# Altium project Pong_PCB.PrjPcb
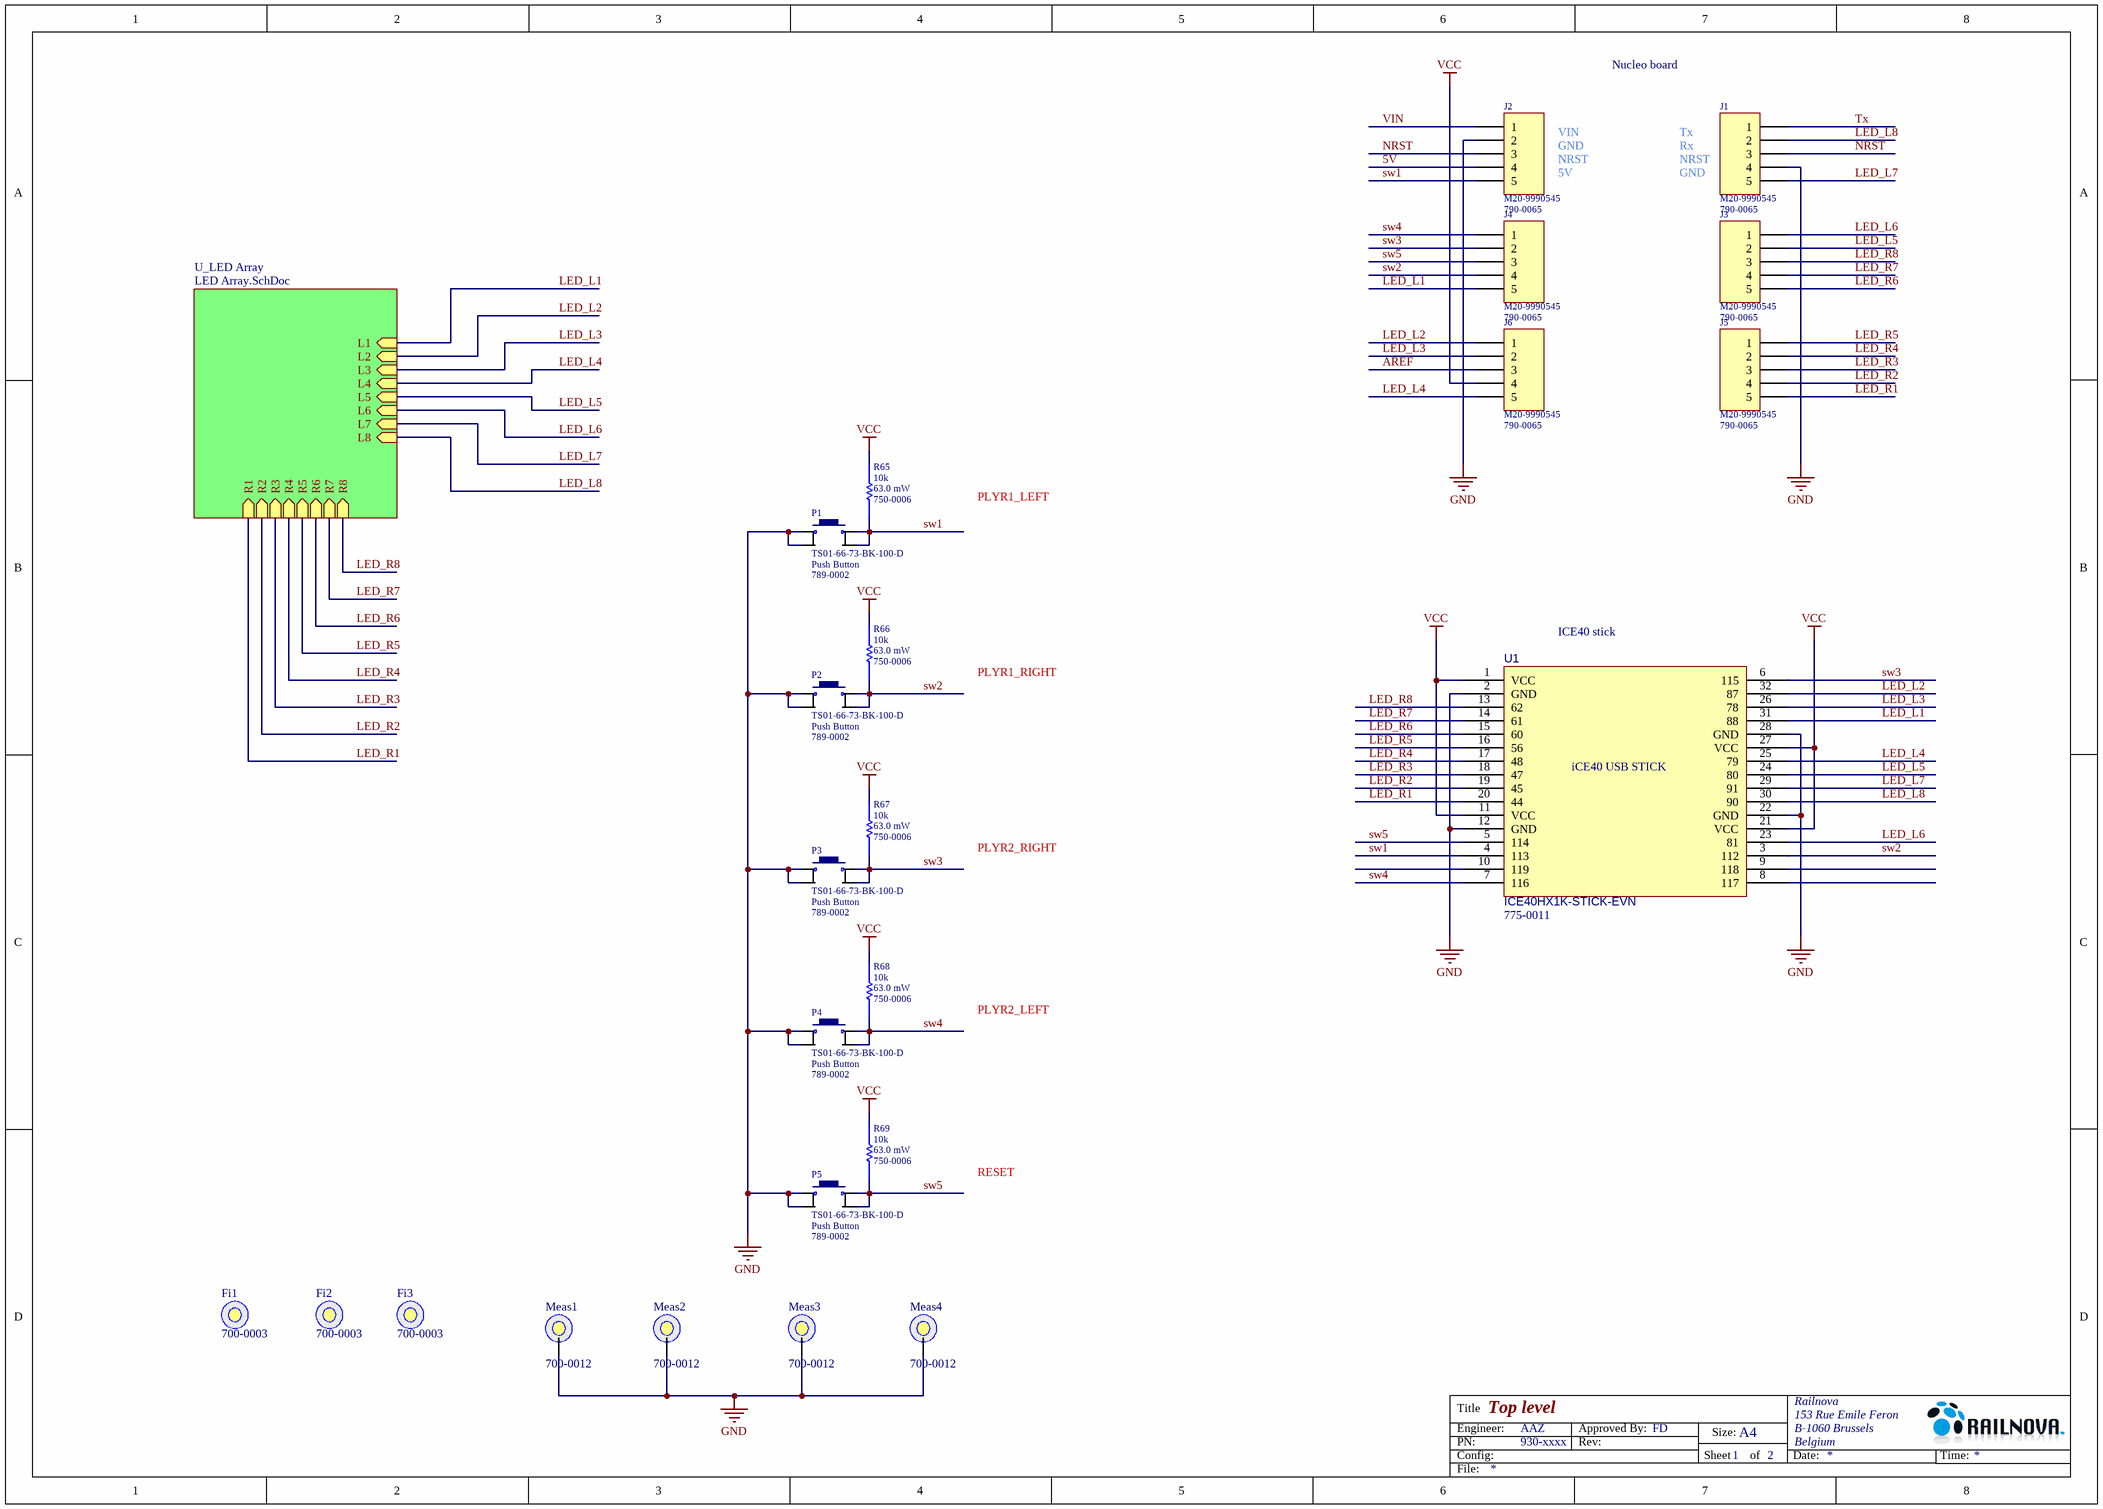
[diagram p0: Top level.SchDoc]
PanelPartNumber: 702-xxxx; PartNumber: 930-xxxx
2 sheets, 104 parts. Net scope: hierarchical (ports join the sheet entries above them; power ports are global).
Board file: PCB.PcbDoc
Sheets:
  Top level.SchDoc
    U_LED Array = LED Array.SchDoc

## Sheet Top level.SchDoc: Top level
size A3; ApprovedBy: FD; Engineer: AAZ; Organization: Railnova; Address1: 58 rue des tanneurs; Address2: B1000 Brussels; Address3: Belgium; SheetNumber: 1; SheetTotal: 2

### Parts
Fi1  700-0003  [Fiducial_1mm]
Fi2  700-0003  [Fiducial_1mm]
Fi3  700-0003  [Fiducial_1mm]
J1  M20-9990545  Part Number: 790-0065  [CON-HDR-VER-M1X5]
J2  M20-9990545  Part Number: 790-0065  [CON-HDR-VER-M1X5]
J3  M20-9990545  Part Number: 790-0065  [CON-HDR-VER-M1X5]
J4  M20-9990545  Part Number: 790-0065  [CON-HDR-VER-M1X5]
J5  M20-9990545  Part Number: 790-0065  [CON-HDR-VER-M1X5]
J6  M20-9990545  Part Number: 790-0065  [CON-HDR-VER-M1X5]
Meas1  700-0012  [FOX_measure_point_3mm]
Meas2  700-0012  [FOX_measure_point_3mm]
Meas3  700-0012  [FOX_measure_point_3mm]
Meas4  700-0012  [FOX_measure_point_3mm]
P1  TS01-66-73-BK-100-D  Component Type: Push Button  Part Number: 789-0002  [TS01-66-70-BK]
P2  TS01-66-73-BK-100-D  Component Type: Push Button  Part Number: 789-0002  [TS01-66-70-BK]
P3  TS01-66-73-BK-100-D  Component Type: Push Button  Part Number: 789-0002  [TS01-66-70-BK]
P4  TS01-66-73-BK-100-D  Component Type: Push Button  Part Number: 789-0002  [TS01-66-70-BK]
P5  TS01-66-73-BK-100-D  Component Type: Push Button  Part Number: 789-0002  [TS01-66-70-BK]
R65  10k  Pmax: 63.0 mW  Part Number: 750-0006  [R0402-IPC-MD]
R66  10k  Pmax: 63.0 mW  Part Number: 750-0006  [R0402-IPC-MD]
R67  10k  Pmax: 63.0 mW  Part Number: 750-0006  [R0402-IPC-MD]
R68  10k  Pmax: 63.0 mW  Part Number: 750-0006  [R0402-IPC-MD]
R69  10k  Pmax: 63.0 mW  Part Number: 750-0006  [R0402-IPC-MD]
U1  ICE40HX1K-STICK-EVN  Part Number: 775-0011  [ICE-stick]

### Sub-sheets
U_LED Array = LED Array.SchDoc: R1 (in), R2 (in), R3 (in), R4 (in), R5 (in), R6 (in), R7 (in), R8 (in), L1 (in), L2 (in), L3 (in), L4 (in), L5 (in), L6 (in), L7 (in), L8 (in)

### Nets
GND: J1.4 J2.2 Meas1.pad(GND) Meas2.pad(GND) Meas3.pad(GND) Meas4.pad(GND) P1.1 P1.2 P2.1 P2.2 P3.1 P3.2 P4.1 P4.2 P5.1 P5.2 U1.2(GND) U1.12(GND) U1.22(GND) U1.28(GND)
VCC: J6.4 R65.2 R66.2 R67.2 R68.2 R69.2 U1.1(VCC) U1.11(VCC) U1.21(VCC) U1.27(VCC)
5V: J2.4
AREF: J6.3
LED_L1: J4.5 U1.31(88) ; sheet U_LED Array/L1
LED_L2: J6.1 U1.32(87) ; sheet U_LED Array/L2
LED_L3: J6.2 U1.26(78) ; sheet U_LED Array/L3
LED_L4: J6.5 U1.25(79) ; sheet U_LED Array/L4
LED_L5: J3.2 U1.24(80) ; sheet U_LED Array/L5
LED_L6: J3.1 U1.23(81) ; sheet U_LED Array/L6
LED_L7: J1.5 U1.29(91) ; sheet U_LED Array/L7
LED_L8: J1.2 U1.30(90) ; sheet U_LED Array/L8
LED_R1: J5.5 U1.20(44) ; sheet U_LED Array/R1
LED_R2: J5.4 U1.19(45) ; sheet U_LED Array/R2
LED_R3: J5.3 U1.18(47) ; sheet U_LED Array/R3
LED_R4: J5.2 U1.17(48) ; sheet U_LED Array/R4
LED_R5: J5.1 U1.16(56) ; sheet U_LED Array/R5
LED_R6: J3.5 U1.15(60) ; sheet U_LED Array/R6
LED_R7: J3.4 U1.14(61) ; sheet U_LED Array/R7
LED_R8: J3.3 U1.13(62) ; sheet U_LED Array/R8
NRST: J1.3 J2.3
sw1: J2.5 P1.3 P1.4 R65.1 U1.4(113)
sw2: J4.4 P2.3 P2.4 R66.1 U1.3(112)
sw3: J4.2 P3.3 P3.4 R67.1 U1.6(115)
sw4: J4.1 P4.3 P4.4 R68.1 U1.7(116)
sw5: J4.3 P5.3 P5.4 R69.1 U1.5(114)
Tx: J1.1
VIN: J2.1

Not connected (* = marked no-connect by the designer): U1 8(117) 9(118) 10(119)

### Notes on the sheet
- Nucleo board
- VIN
- NRST
- 5V
- GND
- Tx
- Rx
- PLYR1_LEFT
- (near U1) ICE40 stick
- PLYR1_RIGHT
- PLYR2_RIGHT
- PLYR2_LEFT
- RESET
- Title
- PN:
- Engineer:
- Config:
- Rev:
- Approved By:
- Sheet
- Size:
- A4
- of
- Date:
- Railnova
- 153 Rue Emile Feron
- B-1060 Brussels
- Belgium
- Time:
- File:
- (in symbol 775-0011) iCE40 USB STICK

### Library data of the parts
Fi1-Fi3 = 700-0003: Fiducial; Rev: A; Part Number: 700-0003; MPN: Fiducial; Status: Review; Component Type: Fiducial; MSL: NA; Revision: A; Revision Date: 2020-09-14; Revision Note: Created; Package: Fiducial; Pin Count: 1; ComponentLink1Description: ACM; ComponentLink1URL: https://acm.railnova.io/admin/altium_library/component/3/change/
J1-J6 = 790-0065: CONN REC HDR VERTICAL MALE 1X5 P0.1in; Manufacturer: HARWIN; Rows: 1; Cols: 5; Pitch: 0.1in; Vmax: 750V; Imax: 3A; Rev: A; MPN: M20-9990545; Status: Review; Component Type: REC; MSL: 1; Revision: A; Revision Date: 2020-09-14; Revision Note: Created; Package: HDR 2.54mm; Pin Count: 5; Style: HDR; Angle: VERTICAL; Gender: MALE; ComponentLink1Description: ACM; ComponentLink1URL: https://acm.railnova.io/admin/altium_library/component/326/change/
Meas1-Meas4 = 700-0012: Measuring point for FOX, 3mm without soldermask; MPN: MeasurePoint; Rev: C; Part Number: 700-0012; Status: Review; Component Type: Fiducial; MSL: NA; Revision: D; Revision Date: 2021-12-03; Revision Note: Schematic FOX_measure_point_3mm was updated on EDA-rnlib2 repository.; Package: 3mm; Pin Count: 1; ComponentLink1Description: ACM; ComponentLink1URL: https://acm.railnova.io/admin/altium_library/component/448/change/
P1-P5 = 789-0002: Push Button 6 x 6 mm, 7 mm Act Height, 100 gf, Black, Short Crimped, Through Hole, SPST; Resistance: 100mOhm; Imax: 50mA; Vmax: 12V; Pmax: 0.6W; Rev: A; MPN: TS01-66-73-BK-100-D; Status: Review; MSL: 1; Revision: B; Revision Date: 2022-04-14; Revision Note: ok; Package: WS-TUS; Pin Count: 4; Style: Through Hole; ComponentLink1Description: ACM; ComponentLink1URL: https://acm.railnova.io/admin/altium_library/component/498/change/; ComponentLink2Description: Datasheet; ComponentLink2URL: https://www.mouser.be/datasheet/2/670/ts01-2586199.pdf
R65-R69 = 750-0006: Resistor 10k 0402 1% 63.0 mW; MPN: CRCW040210K0FKED; Manufacturer: VISHAY; Tcoef: 100 ppm/C; Vmax: 50.0 V; Rev: A; Package: 0402; Status: Active; Component Type: Thick Film; MSL: 1; Value: 10k; Revision: C; Revision Date: 2021-04-21; Revision Note: OK; Pin Count: 2; Tolerance: 1%; ComponentLink1Description: ACM; ComponentLink1URL: https://acm.railnova.io/admin/altium_library/component/109/change/
U1 = 775-0011: iCE40 FPGA USB stick; Manufacturer: LATTICE SEMICONDUCTOR; Part Description: IEEE 802.11a/b/g/n Wi-Fi, Bluetooth 3.0+HS Module; Rev: A; MPN: ICE40HX1K-STICK-EVN; Status: Draft; Component Type: SOM; MSL: NA; Revision: A; Revision Date: 2022-04-14; Revision Note: Created by Abdellah Azaanoun; Package: SOM; Pin Count: 32; ComponentLink1Description: ACM; ComponentLink1URL: https://acm.railnova.io/admin/altium_library/component/501/change/; ComponentLink2Description: Datasheet; ComponentLink2URL: https://www.farnell.com/datasheets/1737019.pdf

## Sheet LED Array.SchDoc: 64-LED-Array
size A3; ApprovedBy: FD; Engineer: AAZ; Organization: Railnova; Address1: 58 rue des tanneurs; Address2: B1000 Brussels; Address3: Belgium; SheetNumber: 2; SheetTotal: 2
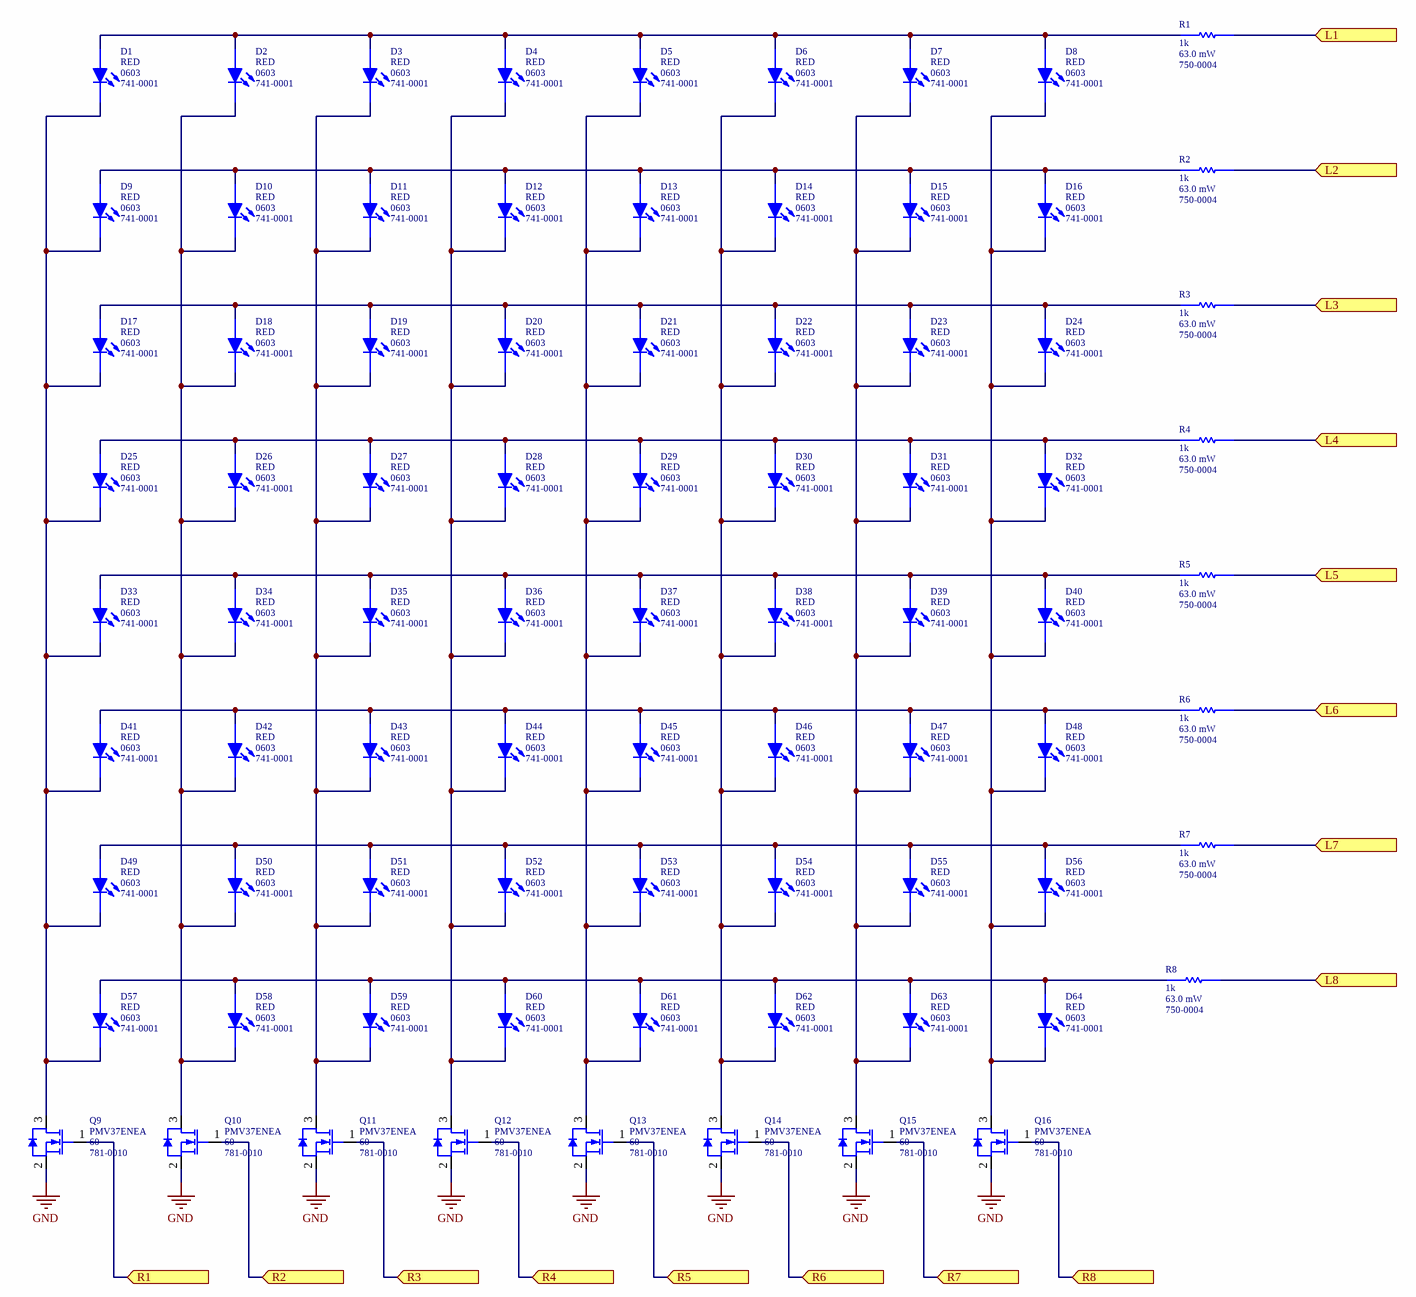
[diagram p1: LED Array.SchDoc]

### Parts
D1  RED  Package: 0603  Part Number: 741-0001  [LED0603-IPC-MD]
D2  RED  Package: 0603  Part Number: 741-0001  [LED0603-IPC-MD]
D3  RED  Package: 0603  Part Number: 741-0001  [LED0603-IPC-MD]
D4  RED  Package: 0603  Part Number: 741-0001  [LED0603-IPC-MD]
D5  RED  Package: 0603  Part Number: 741-0001  [LED0603-IPC-MD]
D6  RED  Package: 0603  Part Number: 741-0001  [LED0603-IPC-MD]
D7  RED  Package: 0603  Part Number: 741-0001  [LED0603-IPC-MD]
D8  RED  Package: 0603  Part Number: 741-0001  [LED0603-IPC-MD]
D9  RED  Package: 0603  Part Number: 741-0001  [LED0603-IPC-MD]
D10  RED  Package: 0603  Part Number: 741-0001  [LED0603-IPC-MD]
D11  RED  Package: 0603  Part Number: 741-0001  [LED0603-IPC-MD]
D12  RED  Package: 0603  Part Number: 741-0001  [LED0603-IPC-MD]
D13  RED  Package: 0603  Part Number: 741-0001  [LED0603-IPC-MD]
D14  RED  Package: 0603  Part Number: 741-0001  [LED0603-IPC-MD]
D15  RED  Package: 0603  Part Number: 741-0001  [LED0603-IPC-MD]
D16  RED  Package: 0603  Part Number: 741-0001  [LED0603-IPC-MD]
D17  RED  Package: 0603  Part Number: 741-0001  [LED0603-IPC-MD]
D18  RED  Package: 0603  Part Number: 741-0001  [LED0603-IPC-MD]
D19  RED  Package: 0603  Part Number: 741-0001  [LED0603-IPC-MD]
D20  RED  Package: 0603  Part Number: 741-0001  [LED0603-IPC-MD]
D21  RED  Package: 0603  Part Number: 741-0001  [LED0603-IPC-MD]
D22  RED  Package: 0603  Part Number: 741-0001  [LED0603-IPC-MD]
D23  RED  Package: 0603  Part Number: 741-0001  [LED0603-IPC-MD]
D24  RED  Package: 0603  Part Number: 741-0001  [LED0603-IPC-MD]
D25  RED  Package: 0603  Part Number: 741-0001  [LED0603-IPC-MD]
D26  RED  Package: 0603  Part Number: 741-0001  [LED0603-IPC-MD]
D27  RED  Package: 0603  Part Number: 741-0001  [LED0603-IPC-MD]
D28  RED  Package: 0603  Part Number: 741-0001  [LED0603-IPC-MD]
D29  RED  Package: 0603  Part Number: 741-0001  [LED0603-IPC-MD]
D30  RED  Package: 0603  Part Number: 741-0001  [LED0603-IPC-MD]
D31  RED  Package: 0603  Part Number: 741-0001  [LED0603-IPC-MD]
D32  RED  Package: 0603  Part Number: 741-0001  [LED0603-IPC-MD]
D33  RED  Package: 0603  Part Number: 741-0001  [LED0603-IPC-MD]
D34  RED  Package: 0603  Part Number: 741-0001  [LED0603-IPC-MD]
D35  RED  Package: 0603  Part Number: 741-0001  [LED0603-IPC-MD]
D36  RED  Package: 0603  Part Number: 741-0001  [LED0603-IPC-MD]
D37  RED  Package: 0603  Part Number: 741-0001  [LED0603-IPC-MD]
D38  RED  Package: 0603  Part Number: 741-0001  [LED0603-IPC-MD]
D39  RED  Package: 0603  Part Number: 741-0001  [LED0603-IPC-MD]
D40  RED  Package: 0603  Part Number: 741-0001  [LED0603-IPC-MD]
D41  RED  Package: 0603  Part Number: 741-0001  [LED0603-IPC-MD]
D42  RED  Package: 0603  Part Number: 741-0001  [LED0603-IPC-MD]
D43  RED  Package: 0603  Part Number: 741-0001  [LED0603-IPC-MD]
D44  RED  Package: 0603  Part Number: 741-0001  [LED0603-IPC-MD]
D45  RED  Package: 0603  Part Number: 741-0001  [LED0603-IPC-MD]
D46  RED  Package: 0603  Part Number: 741-0001  [LED0603-IPC-MD]
D47  RED  Package: 0603  Part Number: 741-0001  [LED0603-IPC-MD]
D48  RED  Package: 0603  Part Number: 741-0001  [LED0603-IPC-MD]
D49  RED  Package: 0603  Part Number: 741-0001  [LED0603-IPC-MD]
D50  RED  Package: 0603  Part Number: 741-0001  [LED0603-IPC-MD]
D51  RED  Package: 0603  Part Number: 741-0001  [LED0603-IPC-MD]
D52  RED  Package: 0603  Part Number: 741-0001  [LED0603-IPC-MD]
D53  RED  Package: 0603  Part Number: 741-0001  [LED0603-IPC-MD]
D54  RED  Package: 0603  Part Number: 741-0001  [LED0603-IPC-MD]
D55  RED  Package: 0603  Part Number: 741-0001  [LED0603-IPC-MD]
D56  RED  Package: 0603  Part Number: 741-0001  [LED0603-IPC-MD]
D57  RED  Package: 0603  Part Number: 741-0001  [LED0603-IPC-MD]
D58  RED  Package: 0603  Part Number: 741-0001  [LED0603-IPC-MD]
D59  RED  Package: 0603  Part Number: 741-0001  [LED0603-IPC-MD]
D60  RED  Package: 0603  Part Number: 741-0001  [LED0603-IPC-MD]
D61  RED  Package: 0603  Part Number: 741-0001  [LED0603-IPC-MD]
D62  RED  Package: 0603  Part Number: 741-0001  [LED0603-IPC-MD]
D63  RED  Package: 0603  Part Number: 741-0001  [LED0603-IPC-MD]
D64  RED  Package: 0603  Part Number: 741-0001  [LED0603-IPC-MD]
Q9  PMV37ENEA  Vds Max: 60  Part Number: 781-0010  [SOT-23]
Q10  PMV37ENEA  Vds Max: 60  Part Number: 781-0010  [SOT-23]
Q11  PMV37ENEA  Vds Max: 60  Part Number: 781-0010  [SOT-23]
Q12  PMV37ENEA  Vds Max: 60  Part Number: 781-0010  [SOT-23]
Q13  PMV37ENEA  Vds Max: 60  Part Number: 781-0010  [SOT-23]
Q14  PMV37ENEA  Vds Max: 60  Part Number: 781-0010  [SOT-23]
Q15  PMV37ENEA  Vds Max: 60  Part Number: 781-0010  [SOT-23]
Q16  PMV37ENEA  Vds Max: 60  Part Number: 781-0010  [SOT-23]
R1  1k  Pmax: 63.0 mW  Part Number: 750-0004  [R0402-IPC-MD]
R2  1k  Pmax: 63.0 mW  Part Number: 750-0004  [R0402-IPC-MD]
R3  1k  Pmax: 63.0 mW  Part Number: 750-0004  [R0402-IPC-MD]
R4  1k  Pmax: 63.0 mW  Part Number: 750-0004  [R0402-IPC-MD]
R5  1k  Pmax: 63.0 mW  Part Number: 750-0004  [R0402-IPC-MD]
R6  1k  Pmax: 63.0 mW  Part Number: 750-0004  [R0402-IPC-MD]
R7  1k  Pmax: 63.0 mW  Part Number: 750-0004  [R0402-IPC-MD]
R8  1k  Pmax: 63.0 mW  Part Number: 750-0004  [R0402-IPC-MD]

### Ports
L1 (in), L2 (in), L3 (in), L4 (in), L5 (in), L6 (in), L7 (in), L8 (in), R1 (in), R2 (in), R3 (in), R4 (in), R5 (in), R6 (in), R7 (in), R8 (in)

### Nets
GND: Q9.2(S) Q10.2(S) Q11.2(S) Q12.2(S) Q13.2(S) Q14.2(S) Q15.2(S) Q16.2(S)
LED_L1: R1.2 ; port L1
LED_L2: R2.2 ; port L2
LED_L3: R3.2 ; port L3
LED_L4: R4.2 ; port L4
LED_L5: R5.2 ; port L5
LED_L6: R6.2 ; port L6
LED_L7: R7.2 ; port L7
LED_L8: R8.2 ; port L8
LED_R1: Q9.1(G) ; port R1
LED_R2: Q10.1(G) ; port R2
LED_R3: Q11.1(G) ; port R3
LED_R4: Q12.1(G) ; port R4
LED_R5: Q13.1(G) ; port R5
LED_R6: Q14.1(G) ; port R6
LED_R7: Q15.1(G) ; port R7
LED_R8: Q16.1(G) ; port R8
NetD1_1: D1.1(K) D9.1(K) D17.1(K) D25.1(K) D33.1(K) D41.1(K) D49.1(K) D57.1(K) Q9.3(D)
NetD1_2: D1.2(A) D2.2(A) D3.2(A) D4.2(A) D5.2(A) D6.2(A) D7.2(A) D8.2(A) R1.1
NetD2_1: D2.1(K) D10.1(K) D18.1(K) D26.1(K) D34.1(K) D42.1(K) D50.1(K) D58.1(K) Q10.3(D)
NetD3_1: D3.1(K) D11.1(K) D19.1(K) D27.1(K) D35.1(K) D43.1(K) D51.1(K) D59.1(K) Q11.3(D)
NetD4_1: D4.1(K) D12.1(K) D20.1(K) D28.1(K) D36.1(K) D44.1(K) D52.1(K) D60.1(K) Q12.3(D)
NetD5_1: D5.1(K) D13.1(K) D21.1(K) D29.1(K) D37.1(K) D45.1(K) D53.1(K) D61.1(K) Q13.3(D)
NetD6_1: D6.1(K) D14.1(K) D22.1(K) D30.1(K) D38.1(K) D46.1(K) D54.1(K) D62.1(K) Q14.3(D)
NetD7_1: D7.1(K) D15.1(K) D23.1(K) D31.1(K) D39.1(K) D47.1(K) D55.1(K) D63.1(K) Q15.3(D)
NetD8_1: D8.1(K) D16.1(K) D24.1(K) D32.1(K) D40.1(K) D48.1(K) D56.1(K) D64.1(K) Q16.3(D)
NetD9_2: D9.2(A) D10.2(A) D11.2(A) D12.2(A) D13.2(A) D14.2(A) D15.2(A) D16.2(A) R2.1
NetD17_2: D17.2(A) D18.2(A) D19.2(A) D20.2(A) D21.2(A) D22.2(A) D23.2(A) D24.2(A) R3.1
NetD25_2: D25.2(A) D26.2(A) D27.2(A) D28.2(A) D29.2(A) D30.2(A) D31.2(A) D32.2(A) R4.1
NetD33_2: D33.2(A) D34.2(A) D35.2(A) D36.2(A) D37.2(A) D38.2(A) D39.2(A) D40.2(A) R5.1
NetD41_2: D41.2(A) D42.2(A) D43.2(A) D44.2(A) D45.2(A) D46.2(A) D47.2(A) D48.2(A) R6.1
NetD49_2: D49.2(A) D50.2(A) D51.2(A) D52.2(A) D53.2(A) D54.2(A) D55.2(A) D56.2(A) R7.1
NetD57_2: D57.2(A) D58.2(A) D59.2(A) D60.2(A) D61.2(A) D62.2(A) D63.2(A) D64.2(A) R8.1

### Notes on the sheet
- Title
- PN:
- Engineer:
- Config:
- Rev:
- Approved By:
- Sheet
- Size:
- A4
- of
- Date:
- Railnova
- 153 Rue Emile Feron
- B-1060 Brussels
- Belgium
- Time:
- File:

### Library data of the parts
D1-D64 = 741-0001: LED RED 0603 2V 20mA 75mW; MPN: VLMS1300-GS08; Manufacturer: VISHAY; Rev: A; Status: Active; Component Type: LED; MSL: 3; Revision: C; Revision Date: 2021-04-21; Revision Note: ok; Pin Count: 2; Color: RED; Vf: 2V; If: 20mA; Pmax: 75mW; ComponentLink1Description: ACM; ComponentLink1URL: https://acm.railnova.io/admin/altium_library/component/99/change/
Q9-Q16 = 781-0010: 60 V, N-channel Trench MOSFET; Manufacturer: NEXPERIA; Value: 60V 3.5A; Rds On 4.5: 0.045; Rds On 10: 0.037; Vgs Th: 1.7-2.3; Id Max: 3.5; Id Pk: 17; Qg: 8.8E-9; Qgd: 1.8E-9; Rev: A; MPN: PMV37ENEA; Status: Review; Component Type: N-Ch; MSL: 1; Revision: C; Revision Date: 2021-04-16; Revision Note: Footprint SOT-23 was updated on EDA-rnlib2 repository.; Package: SOT-23; Pin Count: 3; ComponentLink1Description: ACM; ComponentLink1URL: https://acm.railnova.io/admin/altium_library/component/386/change/; ComponentLink2Description: Datasheet; ComponentLink2URL: https://assets.nexperia.com/documents/data-sheet/PMV37ENEA.pdf
R1-R8 = 750-0004: Resistor 1k 0402 1% 63.0 mW; MPN: CRCW04021K00FKED; Manufacturer: VISHAY; Tcoef: 100 ppm/C; Vmax: 50.0 V; Rev: A; Package: 0402; Status: Active; Component Type: Thick Film; MSL: 1; Value: 1k; Revision: C; Revision Date: 2022-02-18; Revision Note: OK; Pin Count: 2; Tolerance: 1%; ComponentLink1Description: ACM; ComponentLink1URL: https://acm.railnova.io/admin/altium_library/component/107/change/

## Nets that join several sheets
GND: Top level (20 pins), LED Array (8 pins)
LED_L1: Top level (J4.5 U1.31), LED Array (R1.2)
LED_L2: Top level (J6.1 U1.32), LED Array (R2.2)
LED_L3: Top level (J6.2 U1.26), LED Array (R3.2)
LED_L4: Top level (J6.5 U1.25), LED Array (R4.2)
LED_L5: Top level (J3.2 U1.24), LED Array (R5.2)
LED_L6: Top level (J3.1 U1.23), LED Array (R6.2)
LED_L7: Top level (J1.5 U1.29), LED Array (R7.2)
LED_L8: Top level (J1.2 U1.30), LED Array (R8.2)
LED_R1: Top level (J5.5 U1.20), LED Array (Q9.1)
LED_R2: Top level (J5.4 U1.19), LED Array (Q10.1)
LED_R3: Top level (J5.3 U1.18), LED Array (Q11.1)
LED_R4: Top level (J5.2 U1.17), LED Array (Q12.1)
LED_R5: Top level (J5.1 U1.16), LED Array (Q13.1)
LED_R6: Top level (J3.5 U1.15), LED Array (Q14.1)
LED_R7: Top level (J3.4 U1.14), LED Array (Q15.1)
LED_R8: Top level (J3.3 U1.13), LED Array (Q16.1)

## Assembly variants
Standard: all parts fitted